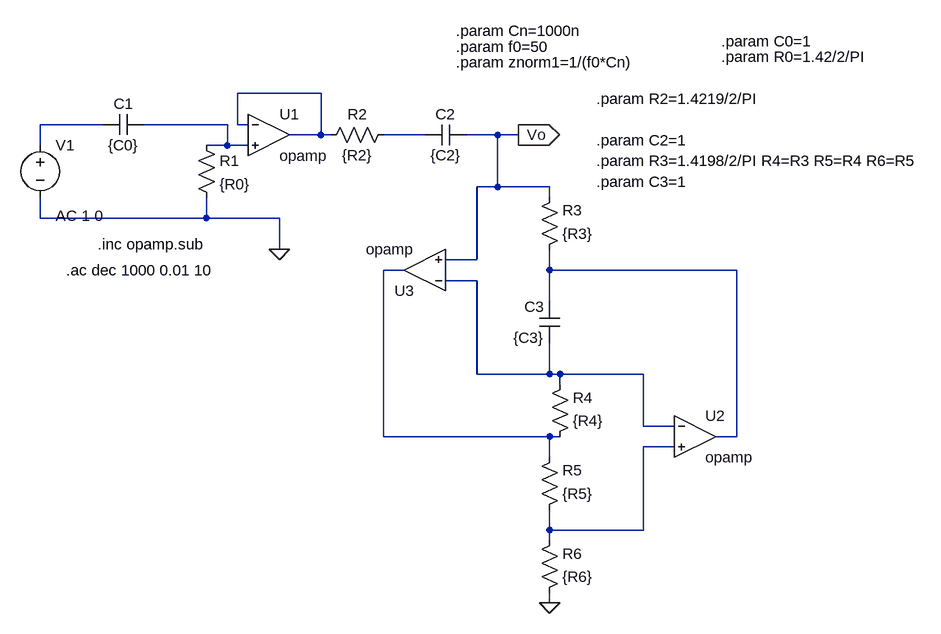
[diagram p0: schematic PTO1_ACT.asc]
PTO1_ACT.asc, the LTspice schematic file:
Version 4
SHEET 1 1488 1044
WIRE 256 48 128 48
WIRE -80 96 -176 96
WIRE 112 96 -16 96
WIRE 128 96 128 48
WIRE 144 96 128 96
WIRE 256 112 256 48
WIRE 256 112 208 112
WIRE 272 112 256 112
WIRE 416 112 352 112
WIRE 528 112 480 112
WIRE 560 112 528 112
WIRE -176 128 -176 96
WIRE 112 128 112 96
WIRE 112 128 80 128
WIRE 144 128 112 128
WIRE 528 192 528 112
WIRE 528 192 496 192
WIRE 608 192 528 192
WIRE 608 208 608 192
WIRE -176 240 -176 208
WIRE 80 240 80 208
WIRE 80 240 -176 240
WIRE 192 240 80 240
WIRE 192 288 192 240
WIRE 496 304 496 192
WIRE 496 304 448 304
WIRE 384 320 352 320
WIRE 608 320 608 288
WIRE 896 320 608 320
WIRE 496 336 448 336
WIRE 608 368 608 320
WIRE 496 480 496 336
WIRE 608 480 608 432
WIRE 608 480 496 480
WIRE 624 480 608 480
WIRE 752 480 624 480
WIRE 624 496 624 480
WIRE 752 560 752 480
WIRE 800 560 752 560
WIRE 352 576 352 320
WIRE 608 576 352 576
WIRE 624 576 608 576
WIRE 896 576 896 320
WIRE 896 576 864 576
WIRE 800 592 752 592
WIRE 608 608 608 576
WIRE 608 720 608 688
WIRE 752 720 752 592
WIRE 752 720 608 720
WIRE 608 736 608 720
WIRE 608 832 608 816
FLAG 192 288 0
FLAG 560 112 Vo
IOPIN 560 112 Out
FLAG 608 832 0
SYMBOL res 368 96 R90
WINDOW 0 0 56 VBottom 2
WINDOW 3 32 56 VTop 2
SYMATTR InstName R2
SYMATTR Value {R2}
SYMBOL cap 416 128 R270
WINDOW 0 32 32 VTop 2
WINDOW 3 0 32 VBottom 2
SYMATTR InstName C2
SYMATTR Value {C2}
SYMBOL voltage -176 112 R0
WINDOW 123 24 124 Left 2
WINDOW 39 0 0 Left 0
SYMATTR Value2 AC 1 0
SYMATTR InstName V1
SYMATTR Value ""
SYMBOL cap 624 368 M0
SYMATTR InstName C3
SYMATTR Value {C3}
SYMBOL res 592 704 M180
WINDOW 0 36 76 Left 2
WINDOW 3 36 40 Left 2
SYMATTR InstName R5
SYMATTR Value {R5}
SYMBOL Opamps/opamp 832 512 R0
SYMATTR InstName U2
SYMBOL Opamps/opamp 416 384 R180
SYMATTR InstName U3
SYMBOL res 592 832 M180
WINDOW 0 36 76 Left 2
WINDOW 3 36 40 Left 2
SYMATTR InstName R6
SYMATTR Value {R6}
SYMBOL res 592 304 M180
WINDOW 0 36 76 Left 2
WINDOW 3 36 40 Left 2
SYMATTR InstName R3
SYMATTR Value {R3}
SYMBOL res 608 592 M180
WINDOW 0 36 76 Left 2
WINDOW 3 36 40 Left 2
SYMATTR InstName R4
SYMATTR Value {R4}
SYMBOL cap -16 80 R90
WINDOW 0 0 32 VBottom 2
WINDOW 3 32 32 VTop 2
SYMATTR InstName C1
SYMATTR Value {C0}
SYMBOL res 64 112 R0
SYMATTR InstName R1
SYMATTR Value {R0}
SYMBOL Opamps/opamp 176 48 R0
SYMATTR InstName U1
TEXT -136 320 Left 2 !.ac dec 1000 0.01 10
TEXT -88 280 Left 2 !.inc opamp.sub
TEXT 680 56 Left 2 !.param R2=1.4219/2/PI
TEXT 680 120 Left 2 !.param C2=1
TEXT 464 -48 Left 2 !.param Cn=1000n
TEXT 464 -24 Left 2 !.param f0=50
TEXT 464 0 Left 2 !.param znorm1=1/(f0*Cn)
TEXT 680 184 Left 2 !.param C3=1
TEXT 680 152 Left 2 !.param R3=1.4198/2/PI R4=R3 R5=R4 R6=R5
TEXT 872 -32 Left 2 !.param C0=1
TEXT 872 -8 Left 2 !.param R0=1.42/2/PI

The netlist it stands for:
* PTO1_ACT.asc
R2 N004 N001 {R2}
C2 N004 Vo {C2}
V1 N002 0 AC 1 0
C3 N006 N007 {C3}
R5 N008 N005 {R5}
XU2 N007 N008 N006 opamp Aol=100K GBW=10Meg  ; pins invin noninvin out
XU3 N007 Vo N005 opamp Aol=100K GBW=10Meg  ; pins invin noninvin out
R6 0 N008 {R6}
R3 N006 Vo {R3}
R4 N005 N007 {R4}
C1 N003 N002 {C0}
R1 N003 0 {R0}
XU1 N001 N003 N001 opamp Aol=100K GBW=10Meg  ; pins invin noninvin out
.ac dec 1000 0.01 10
.inc opamp.sub
.param R2=1.4219/2/PI
.param C2=1
.param Cn=1000n
.param f0=50
.param znorm1=1/(f0*Cn)
.param C3=1
.param R3=1.4198/2/PI R4=R3 R5=R4 R6=R5
.param C0=1
.param R0=1.42/2/PI
.backanno
.end